# Altium schematic sheet B2B_connectors.SchDoc: AFE Mezzanine
size 420 x 297 mm; Author: K.B.; CompanyName: WUT; DrawnBy: K.B.; Organization: WUT ISE; Address1: Warsaw Univeristy of Technology; Address2: Nowowiejska 15/19; DocumentNumber: 8; SheetNumber: 6; SheetTotal: 12; EDA_Number: ARTIQ; Projet: ARTIQ/SINARA; ModifiedBy: -; CreateDate: XX/XX/XXXX; CheckedDate: -; Title2: Connectors; DivGrp: ISE; Designer: K.B.; ModifiedDate: -; ProjectName: ARTIQ/SINARA
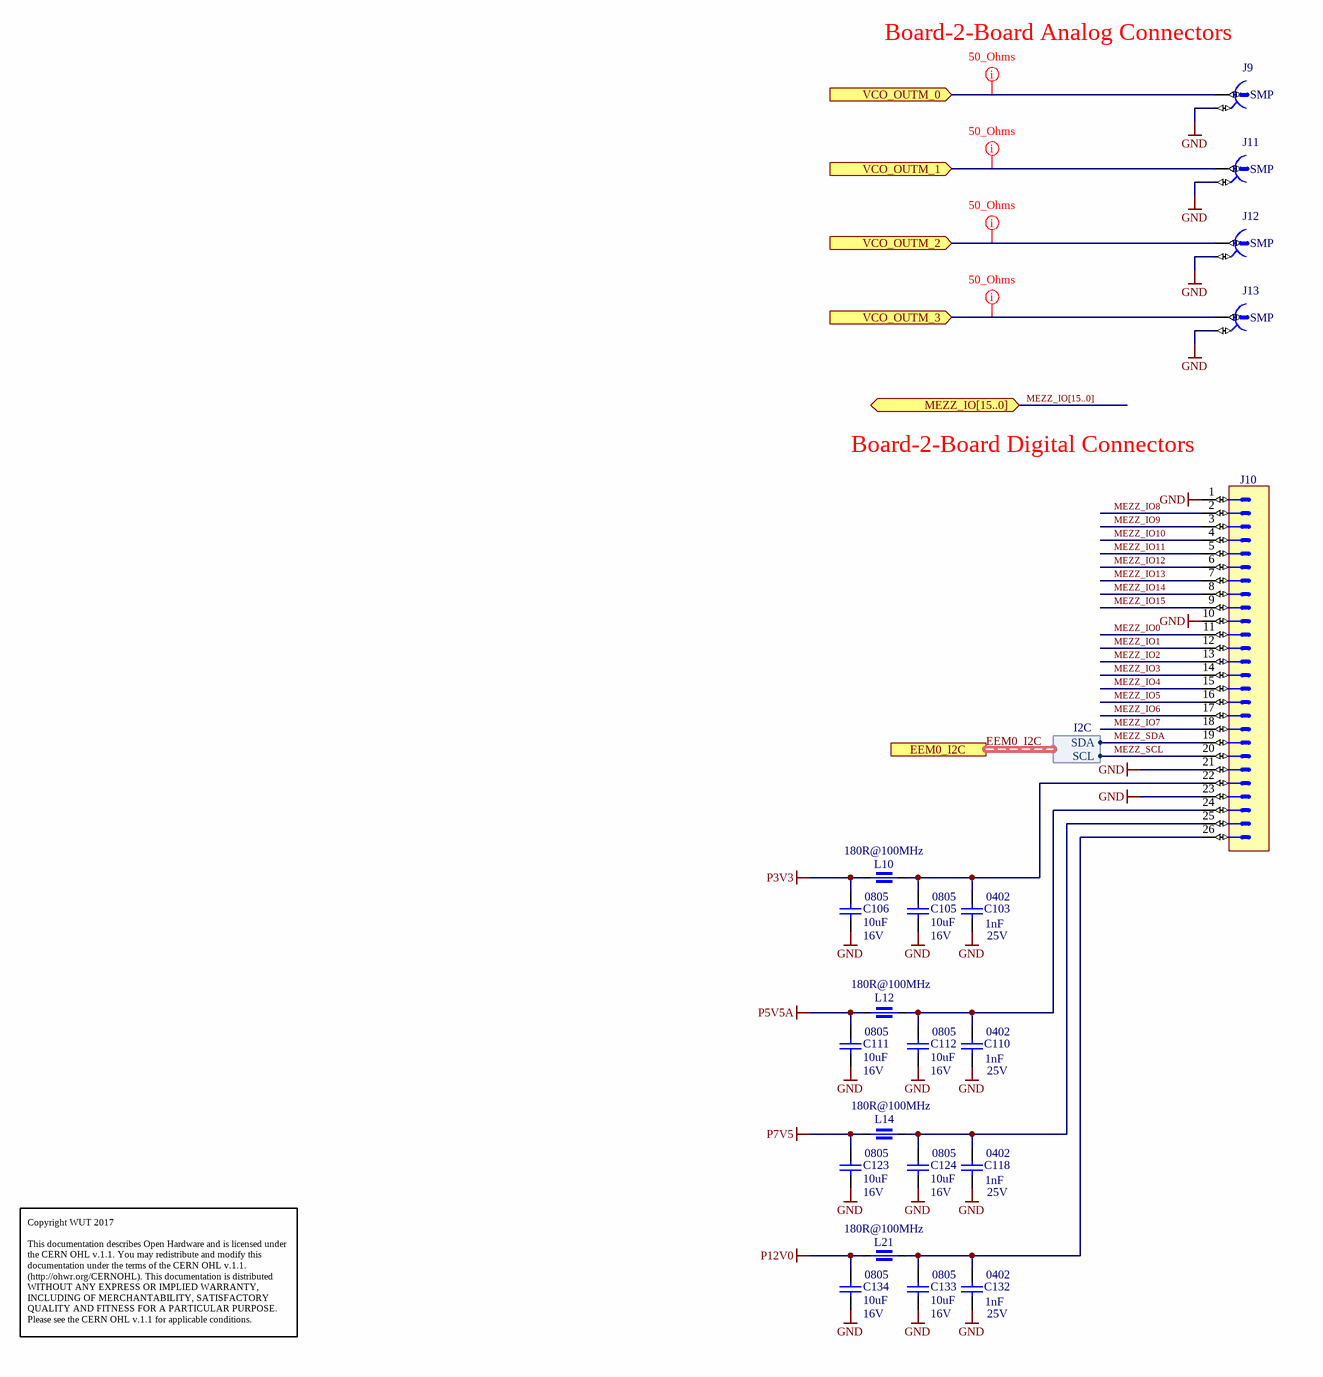
[diagram p0: B2B_connectors.SchDoc]

## Parts
C103  1nF  Voltage: 25V  Case: 0402  [CAPC1005X55N]
C105  10uF  Voltage: 16V  Case: 0805  [CAPC2012X135N]
C106  10uF  Voltage: 16V  Case: 0805  [CAPC2012X135N]
C110  1nF  Voltage: 25V  Case: 0402  [CAPC1005X55N]
C111  10uF  Voltage: 16V  Case: 0805  [CAPC2012X135N]
C112  10uF  Voltage: 16V  Case: 0805  [CAPC2012X135N]
C118  1nF  Voltage: 25V  Case: 0402  [CAPC1005X55N]
C123  10uF  Voltage: 16V  Case: 0805  [CAPC2012X135N]
C124  10uF  Voltage: 16V  Case: 0805  [CAPC2012X135N]
C132  1nF  Voltage: 25V  Case: 0402  [CAPC1005X55N]
C133  10uF  Voltage: 16V  Case: 0805  [CAPC2012X135N]
C134  10uF  Voltage: 16V  Case: 0805  [CAPC2012X135N]
J9  SMP  [MOLEX_85305-0232]
J10  Header 26  [3M_N2526-6002RB]  (value not drawn)
J11  SMP  [MOLEX_85305-0232]
J12  SMP  [MOLEX_85305-0232]
J13  SMP  [MOLEX_85305-0232]
L10  180R@100MHz  [INDC4516X180N]
L12  180R@100MHz  [INDC4516X180N]
L14  180R@100MHz  [INDC4516X180N]
L21  180R@100MHz  [INDC4516X180N]

## Ports
EEM0_I2C (harness I2C), MEZZ_IO[15..0] (bidir), VCO_OUTM_0 (in), VCO_OUTM_1 (in), VCO_OUTM_2 (in), VCO_OUTM_3 (in)

## Harnesses
I2C: SDA, SCL

## Nets
GND: C103.1 C105.1 C106.1 C110.1 C111.1 C112.1 C118.1 C123.1 C124.1 C132.1 C133.1 C134.1 J9.2 J10.1 J10.10 J10.21 J10.23 J11.2 J12.2 J13.2
P3V3: C106.2 L10.2
P5V5A: C111.2 L12.1
P7V5: C123.2 L14.1
P12V0: C134.2 L21.2
MEZZ_IO0: J10.11
MEZZ_IO1: J10.12
MEZZ_IO2: J10.13
MEZZ_IO3: J10.14
MEZZ_IO4: J10.15
MEZZ_IO5: J10.16
MEZZ_IO6: J10.17
MEZZ_IO7: J10.18
MEZZ_IO8: J10.2
MEZZ_IO9: J10.3
MEZZ_IO10: J10.4
MEZZ_IO11: J10.5
MEZZ_IO12: J10.6
MEZZ_IO13: J10.7
MEZZ_IO14: J10.8
MEZZ_IO15: J10.9
MEZZ_SCL: J10.20 ; port EEM0_I2C.SCL  [project net EEM0_I2C.SCL]
MEZZ_SDA: J10.19 ; port EEM0_I2C.SDA  [project net EEM0_I2C.SDA]
VCO_OUTM_0: J9.1 ; port VCO_OUTM_0
VCO_OUTM_1: J11.1 ; port VCO_OUTM_1
VCO_OUTM_2: J12.1 ; port VCO_OUTM_2
VCO_OUTM_3: J13.1 ; port VCO_OUTM_3
NetC103_2: C103.2 C105.2 J10.22 L10.1
NetC110_2: C110.2 C112.2 J10.24 L12.2
NetC118_2: C118.2 C124.2 J10.25 L14.2
NetC132_2: C132.2 C133.2 J10.26 L21.1

## Buses and harness runs
bus MEZZ_IO[15..0] = port MEZZ_IO[15..0]
harness EEM0_I2C = port EEM0_I2C

## Layout directives
net class 50_Ohms: VCO_OUTM_0, VCO_OUTM_1, VCO_OUTM_2, VCO_OUTM_3

## Notes on the sheet
- (near J9) Board-2-Board Analog Connectors
- (near J10) Board-2-Board Digital Connectors
- Copyright WUT 2017
  This documentation describes Open Hardware and is licensed under the CERN OHL v.1.1. You may redistribute and modify this documentation under the terms of the CERN OHL v.1.1. (http://ohwr.org/CERNOHL). This documentation is distributed WITHOUT ANY EXPRESS OR IMPLIED WARRANTY, INCLUDING OF MERCHANTABILITY, SATISFACTORY QUALITY AND FITNESS FOR A PARTICULAR PURPOSE. Please see the CERN OHL v.1.1 for applicable conditions.
- Project/Equipment
- Document
- Designer
- Drawn by
- Check.by
- File
- Last Mod.
- Print Date
- Sheet
- Size
- A3
- of
- Rev

## Library data of the parts
C103 C110 C118 C132 = CC0402_1NF_50V_10%_X7R: Non-polarised capacitor; Part Number: CC0402_1NF_25V_5%_NP0; Part Description: SMD Multilayer Chip Ceramic Capacitor; Manufacturer: GENERIC; Manufacturer1 Part Number: C1005C0G1E102J050BA; TC: NP0; Tolerance: ±5%; Component Kind: Standard; Component Type: Standard; Pin Count: 2; Value: 1nF; Status: Not Recommended; Manufacturer Part Number: CC0402_1NF_25V_5%_NP0; Mounted: Yes; Socket: No; SMD: Yes; Sense: No; Manufacturer1 Example: TDK; Manufacturer1 ComponentHeight: 0.55mm; HelpURL: \\cern.ch\dfs\Applications\Altium\Datasheets\CC0402_X7R_PHYCOMP.pdf; Author: CERN DEM JLC; CreateDate: 03.12.2007; LatestRevisionDate: 03.12.2007
C105 C106 C111 C112 C123 C124 C133 C134 = CC0805_22UF_16V_10%_X5R: Non-polarised capacitor; Part Number: CC0805_10UF_16V_10%_X7R; Part Description: SMD Multilayer Chip Ceramic Capacitor; Manufacturer: GENERIC; Manufacturer1 Part Number: CL21B106KOQNNN; TC: X7R; Tolerance: ±10%; Component Kind: Standard; Component Type: Standard; Pin Count: 2; Value: 10uF; Status: Preferred; Manufacturer Part Number: CC0805_10UF_16V_10%_X7R; Mounted: Yes; Socket: No; SMD: Yes; Sense: No; Manufacturer1 Example: SAMSUNG; Manufacturer1 ComponentHeight: 1.35mm; HelpURL: \\cern.ch\dfs\Applications\Altium\Datasheets\CC0805_X5R_TDK_C.pdf; Author: CERN DEM JLC; CreateDate: 25.10.2012; LatestRevisionDate: 25.10.2012
J9 J11-J13 = MOLEX_85305-0232: Part Description: 50 Ohms, SMP Surface Mount Plug, Limited Detent; Manufacturer: MOLEX; PressFit: No; Part Number: MOLEX_85305-0232; Component Kind: Standard; Component Type: Standard; Pin Count: 2; Family: SMP; Mounted: Yes; Socket: No; SMD: Yes; Sense: No; Status: None; Manufacturer Part Number: 85305-0232; ComponentHeight: 4.1mm; HelpURL: \\cern.ch\dfs\Applications\Altium\Datasheets\MOLEX_85305-0232.pdf; Author: CERN DEM JMW; CreateDate: 09.08.2016; LatestRevisionDate: 09.08.2016
J10 = 3M_N2526-6002RB: Connector 26 Male; Part Description: 26 Contacts - Straight .100'' x .100'' Low Profile Four-Wall Header, 2500 Series; Manufacturer: 3M; PressFit: No; Part Number: 3M_N2526-6002RB; Component Kind: Standard; Component Type: Standard; Pin Count: 26; Family: Header 26; Mounted: Yes; Socket: No; SMD: No; Sense: No; Status: None; Manufacturer Part Number: N2526-6002RB; ComponentHeight: 10.03mm; HelpURL: \\cern.ch\dfs\Applications\Altium\Datasheets\3M_N2526-6002RB.pdf; Author: CERN DEM JLC; CreateDate: 11.02.2009; LatestRevisionDate: 11.08.2009
L10 L12 L14 L21 = IND1806_MURATA_BLM41PG181SN1L: Part Description: SMD EMI Suppression Chip Ferrite Bead (BLM41P Series); Manufacturer: MURATA; Power: 3.5A; Resistance: 0.02R; Part Number: IND1806_MURATA_BLM41PG181SN1L; Component Kind: Standard; Component Type: Standard; Pin Count: 2; Value: 180R@100MHz; Status: None; Manufacturer Part Number: BLM41PG181SN1L; Case: 1806; Mounted: Yes; Socket: No; SMD: Yes; Sense: No; ComponentHeight: 1.8mm; HelpURL: \\cern.ch\dfs\Applications\Altium\Datasheets\IND1806_MURATA_BLM41P.pdf; Author: CERN DEM JLC; CreateDate: 26.06.2012; LatestRevisionDate: 26.06.2012